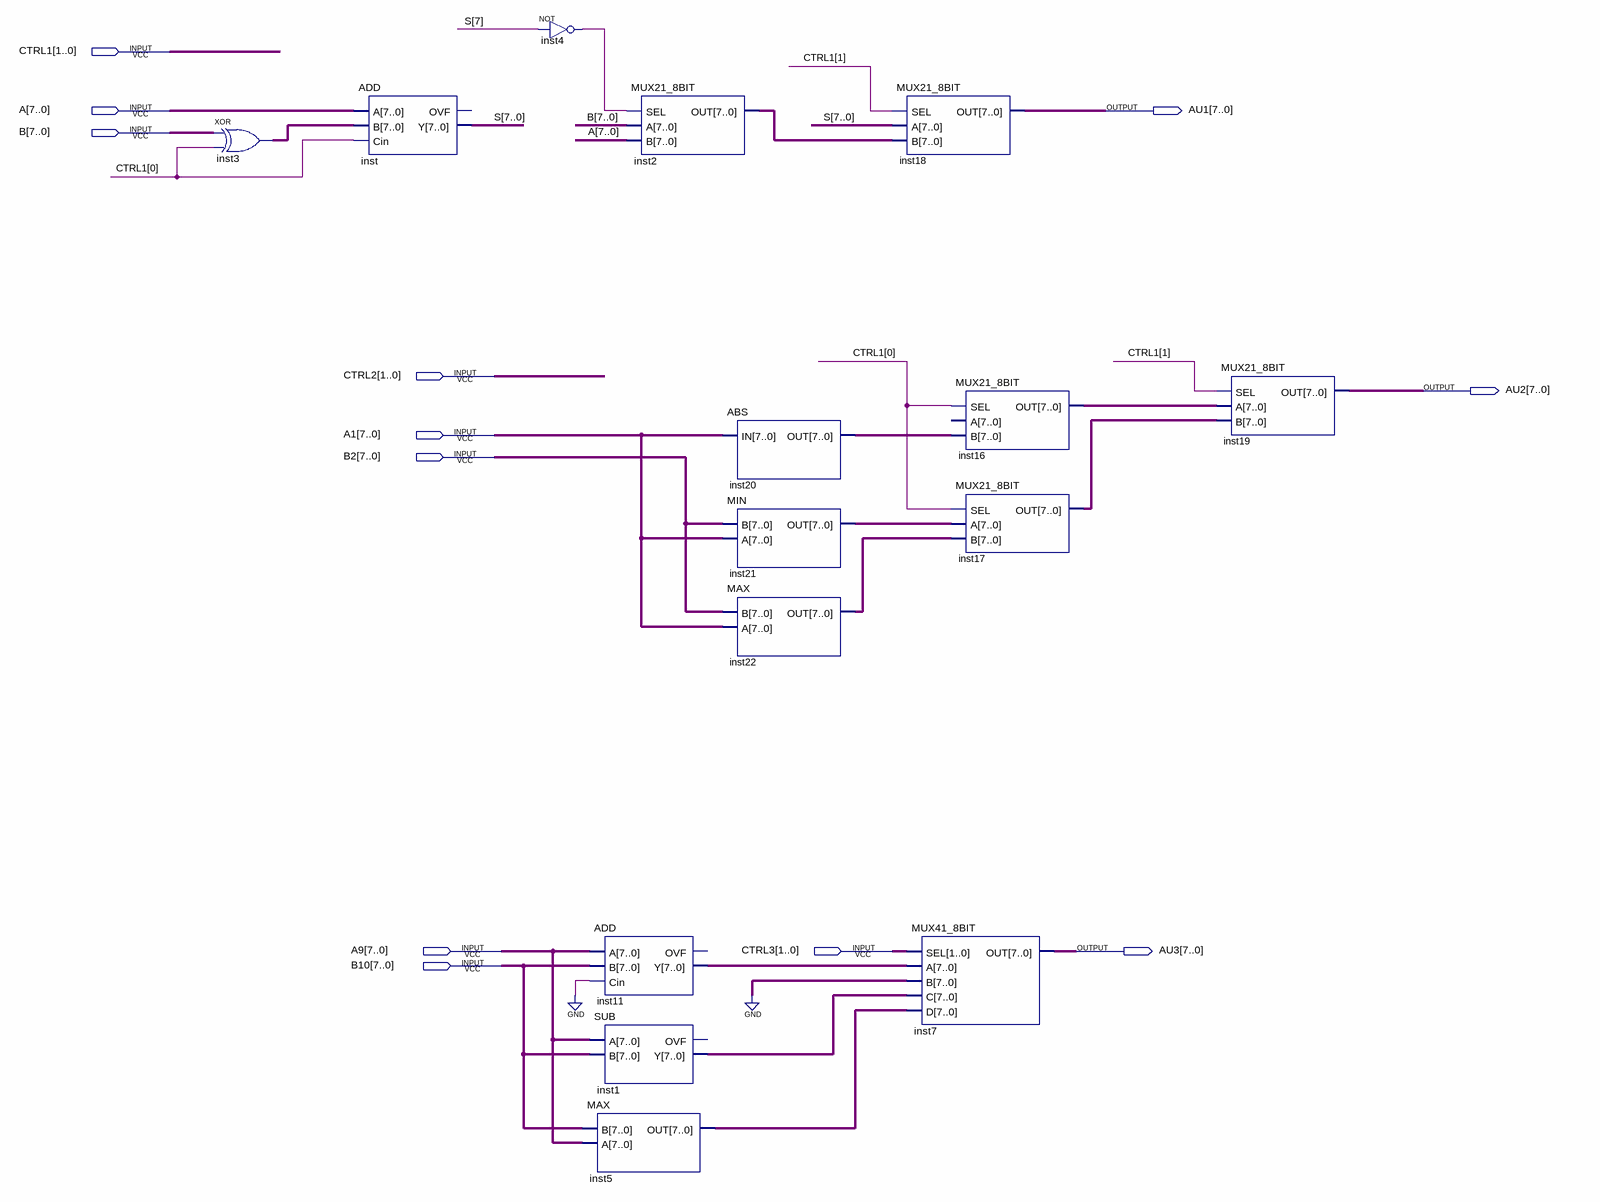
[diagram p0: schematic sheet]
// Quartus schematic SAVE.bdf as structural Verilog: 15 symbols, 12 pins
module SAVE (
  input  [1:0] CTRL1,
  input  [7:0] A,
  input  [7:0] B,
  input  [1:0] CTRL2,
  input  [7:0] A1,
  input  [7:0] B2,
  input  [7:0] A9,
  input  [1:0] CTRL3,
  input  [7:0] B10,
  output [7:0] AU1,
  output [7:0] AU2,
  output [7:0] AU3
);

  wire inst4_out;
  wire [7:0] inst1_y, inst2_out, inst3_out, inst5_out, inst11_y, inst16_out, inst17_out, inst20_out,
       inst21_out, inst22_out, S;

  assign inst3_out = B ^ {8{CTRL1[0]}};  // XOR inst3, 8 bits wide
  ADD inst (.A(A), .B(inst3_out), .Cin(CTRL1[0]), .Y(S));  // open: OVF
  not inst4 (inst4_out, S[7]);
  MUX21_8BIT inst2 (.SEL(inst4_out), .A(B), .B(A), .OUT(inst2_out));
  ADD inst11 (.A(A9), .B(B10), .Cin(1'b0), .Y(inst11_y));  // open: OVF
  SUB inst1 (.A(A9), .B(B10), .Y(inst1_y));  // open: OVF
  MAX inst5 (.B(B10), .A(A9), .OUT(inst5_out));
  ABS inst20 (.IN(A1), .OUT(inst20_out));
  MIN inst21 (.B(B2), .A(A1), .OUT(inst21_out));
  MAX inst22 (.B(B2), .A(A1), .OUT(inst22_out));
  MUX21_8BIT inst18 (.SEL(CTRL1[1]), .A(S), .B(inst2_out), .OUT(AU1));
  MUX41_8BIT inst7 (.SEL(CTRL3), .A(inst11_y), .B({8{1'b0}}), .C(inst1_y), .D(inst5_out), .OUT(AU3));
  MUX21_8BIT inst16 (.SEL(CTRL1[0]), .B(inst20_out), .OUT(inst16_out));  // open: A
  MUX21_8BIT inst17 (.SEL(CTRL1[0]), .A(inst21_out), .B(inst22_out), .OUT(inst17_out));
  MUX21_8BIT inst19 (.SEL(CTRL1[1]), .A(inst16_out), .B(inst17_out), .OUT(AU2));
endmodule
